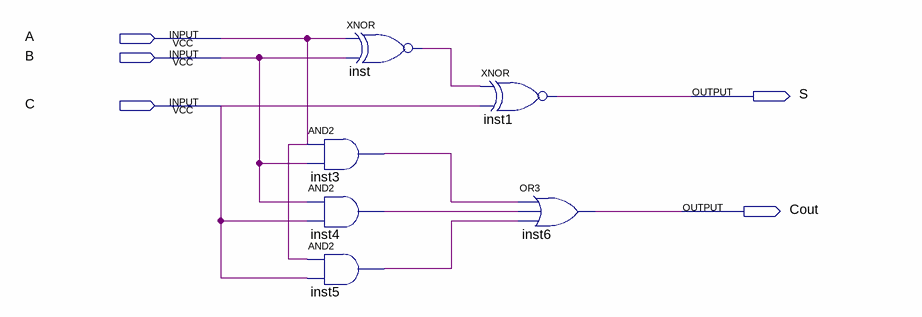
[diagram p0: schematic sheet]
// Quartus schematic FullAdd.bdf as structural Verilog: 6 symbols, 5 pins
module FullAdd (
  input  A,
  input  B,
  input  C,
  output S,
  output Cout
);

  wire inst3_out, inst4_out, inst5_out, inst_out;

  xnor inst (inst_out, A, B);
  and inst3 (inst3_out, A, B);
  and inst4 (inst4_out, B, C);
  and inst5 (inst5_out, A, C);
  xnor inst1 (S, inst_out, C);
  or inst6 (Cout, inst3_out, inst4_out, inst5_out);
endmodule
